# Altium schematic sheet sch_Top.SchDoc
size A4
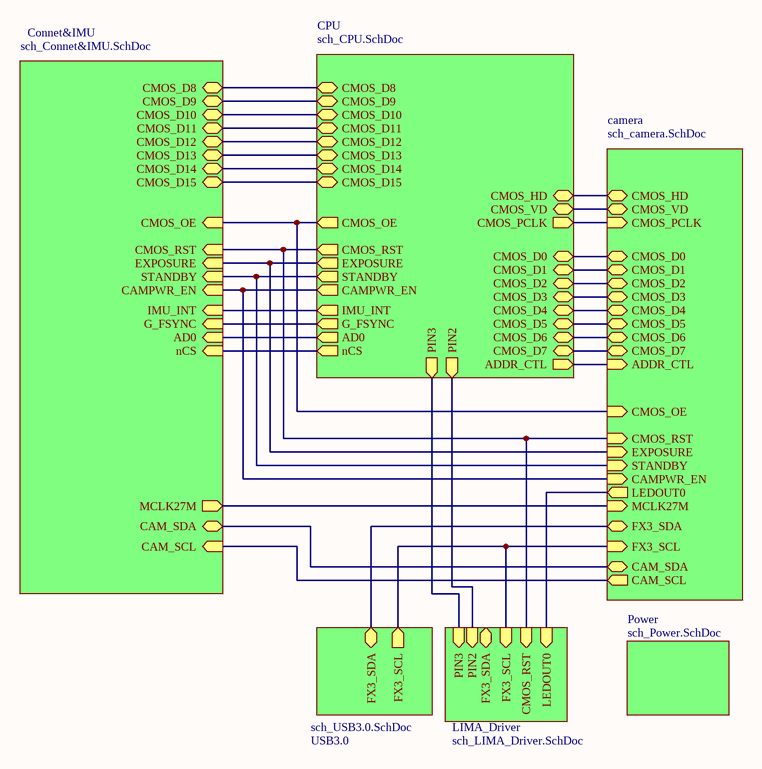
[diagram p0: sch_Top.SchDoc]

## Sub-sheets
camera = sch_camera.SchDoc: CMOS_D0 (bidir), CMOS_D1 (bidir), CMOS_D2 (bidir), CMOS_D3 (bidir), CMOS_D4 (bidir), CMOS_D5 (bidir), CMOS_D6 (bidir), CMOS_D7 (bidir), CAMPWR_EN (in), CMOS_HD (bidir), CMOS_VD (bidir), CMOS_OE (in), CMOS_PCLK (in), CMOS_RST (in), EXPOSURE (in), STANDBY (in), ADDR_CTL (in), FX3_SCL (in), FX3_SDA (bidir), MCLK27M (in), LEDOUT0 (out), CAM_SDA (bidir), CAM_SCL (out)
Connet&IMU = sch_Connet&IMU.SchDoc: CAM_SCL (in), AD0 (in), nCS (in), STANDBY (in), EXPOSURE (in), CMOS_OE (in), CAMPWR_EN (in), CMOS_RST (in), CAM_SDA (bidir), CMOS_D8 (bidir), CMOS_D9 (bidir), CMOS_D10 (bidir), CMOS_D11 (bidir), CMOS_D12 (bidir), CMOS_D13 (bidir), CMOS_D14 (bidir), CMOS_D15 (bidir), IMU_INT (in), G_FSYNC (in), MCLK27M (out)
CPU = sch_CPU.SchDoc: AD0 (out), ADDR_CTL (out), CAMPWR_EN (out), CMOS_D0 (bidir), CMOS_D1 (bidir), CMOS_D2 (bidir), CMOS_D3 (bidir), CMOS_D4 (bidir), CMOS_D5 (bidir), CMOS_D6 (bidir), CMOS_D7 (bidir), CMOS_D8 (bidir), CMOS_D9 (bidir), CMOS_D10 (bidir), CMOS_D11 (bidir), CMOS_D12 (bidir), CMOS_D13 (bidir), CMOS_D14 (bidir), CMOS_D15 (bidir), CMOS_HD (bidir), CMOS_VD (bidir), CMOS_OE (out), CMOS_PCLK (out), CMOS_RST (out), EXPOSURE (out), IMU_INT (out), G_FSYNC (out), STANDBY (out), nCS (out), PIN3 (out), PIN2 (out)
LIMA_Driver = sch_LIMA_Driver.SchDoc: FX3_SDA (bidir), FX3_SCL (in), LEDOUT0 (in), PIN3 (in), PIN2 (in), CMOS_RST (in)
Power = sch_Power.SchDoc: no entries
USB3.0 = sch_USB3.0.SchDoc: FX3_SDA (bidir), FX3_SCL (out)

## Nets
(unnamed): sheet CPU/AD0, sheet Connet&IMU/AD0
(unnamed): sheet CPU/ADDR_CTL, sheet camera/ADDR_CTL
(unnamed): sheet CPU/CAMPWR_EN, sheet Connet&IMU/CAMPWR_EN, sheet camera/CAMPWR_EN
(unnamed): sheet CPU/CMOS_D0, sheet camera/CMOS_D0
(unnamed): sheet CPU/CMOS_D1, sheet camera/CMOS_D1
(unnamed): sheet CPU/CMOS_D2, sheet camera/CMOS_D2
(unnamed): sheet CPU/CMOS_D3, sheet camera/CMOS_D3
(unnamed): sheet CPU/CMOS_D4, sheet camera/CMOS_D4
(unnamed): sheet CPU/CMOS_D5, sheet camera/CMOS_D5
(unnamed): sheet CPU/CMOS_D6, sheet camera/CMOS_D6
(unnamed): sheet CPU/CMOS_D7, sheet camera/CMOS_D7
(unnamed): sheet CPU/CMOS_D8, sheet Connet&IMU/CMOS_D8
(unnamed): sheet CPU/CMOS_D9, sheet Connet&IMU/CMOS_D9
(unnamed): sheet CPU/CMOS_D10, sheet Connet&IMU/CMOS_D10
(unnamed): sheet CPU/CMOS_D11, sheet Connet&IMU/CMOS_D11
(unnamed): sheet CPU/CMOS_D12, sheet Connet&IMU/CMOS_D12
(unnamed): sheet CPU/CMOS_D13, sheet Connet&IMU/CMOS_D13
(unnamed): sheet CPU/CMOS_D14, sheet Connet&IMU/CMOS_D14
(unnamed): sheet CPU/CMOS_D15, sheet Connet&IMU/CMOS_D15
(unnamed): sheet CPU/CMOS_HD, sheet camera/CMOS_HD
(unnamed): sheet CPU/CMOS_VD, sheet camera/CMOS_VD
(unnamed): sheet CPU/CMOS_OE, sheet Connet&IMU/CMOS_OE, sheet camera/CMOS_OE
(unnamed): sheet CPU/CMOS_PCLK, sheet camera/CMOS_PCLK
(unnamed): sheet CPU/CMOS_RST, sheet Connet&IMU/CMOS_RST, sheet camera/CMOS_RST, sheet LIMA_Driver/CMOS_RST
(unnamed): sheet CPU/EXPOSURE, sheet Connet&IMU/EXPOSURE, sheet camera/EXPOSURE
(unnamed): sheet CPU/IMU_INT, sheet Connet&IMU/IMU_INT
(unnamed): sheet CPU/G_FSYNC, sheet Connet&IMU/G_FSYNC
(unnamed): sheet CPU/STANDBY, sheet Connet&IMU/STANDBY, sheet camera/STANDBY
(unnamed): sheet CPU/nCS, sheet Connet&IMU/nCS
(unnamed): sheet CPU/PIN3, sheet LIMA_Driver/PIN3
(unnamed): sheet CPU/PIN2, sheet LIMA_Driver/PIN2
(unnamed): sheet Connet&IMU/CAM_SCL, sheet camera/CAM_SCL
(unnamed): sheet Connet&IMU/CAM_SDA, sheet camera/CAM_SDA
(unnamed): sheet Connet&IMU/MCLK27M, sheet camera/MCLK27M
(unnamed): sheet camera/FX3_SCL, sheet USB3.0/FX3_SCL, sheet LIMA_Driver/FX3_SCL
(unnamed): sheet camera/FX3_SDA, sheet USB3.0/FX3_SDA
(unnamed): sheet camera/LEDOUT0, sheet LIMA_Driver/LEDOUT0